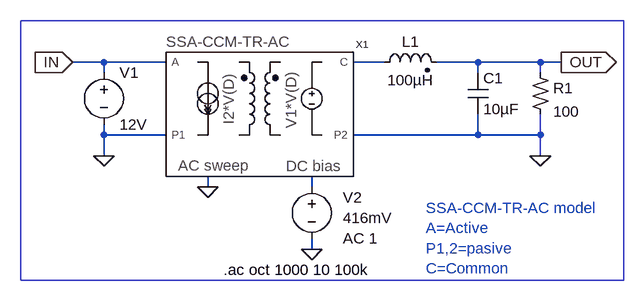
[diagram p0: schematic Switch-Mode_Power_Supplies_-_Basso-_Figure_2-8.asc]
Switch-Mode_Power_Supplies_-_Basso-_Figure_2-8.asc, the LTspice schematic file:
Version 4
SHEET 1 880 680
WIRE -416 -32 -464 -32
WIRE -320 -32 -416 -32
WIRE 16 -32 -32 -32
WIRE 160 -32 96 -32
WIRE 256 -32 160 -32
WIRE 288 -32 256 -32
WIRE -416 -16 -416 -32
WIRE 160 -16 160 -32
WIRE 256 -16 256 -32
WIRE -416 80 -416 64
WIRE -320 80 -416 80
WIRE 160 80 160 48
WIRE 160 80 -32 80
WIRE 256 80 256 48
WIRE 256 80 160 80
WIRE -416 112 -416 80
WIRE 256 112 256 80
WIRE -256 160 -256 144
WIRE -96 160 -96 144
WIRE -96 256 -96 240
FLAG -416 112 0
FLAG -96 256 0
FLAG 288 -32 OUT
IOPIN 288 -32 Out
FLAG -464 -32 IN
IOPIN -464 -32 In
FLAG 256 112 0
FLAG -256 160 0
SYMBOL voltage -416 -32 R0
WINDOW 123 0 0 Left 0
WINDOW 39 0 0 Left 0
SYMATTR InstName V1
SYMATTR Value 12V
SYMBOL voltage -96 144 R0
WINDOW 123 48 95 Left 0
WINDOW 39 0 0 Left 0
WINDOW 0 48 32 Left 0
WINDOW 3 48 64 Left 0
SYMATTR Value2 AC 1
SYMATTR InstName V2
SYMATTR Value 416mV
SYMBOL ind2 0 -16 R270
WINDOW 0 32 56 VTop 0
WINDOW 3 4 56 VBottom 0
SYMATTR InstName L1
SYMATTR Value 100µH
SYMBOL cap 144 -16 R0
SYMATTR InstName C1
SYMATTR Value 10µF
SYMBOL res2 240 -16 R0
SYMATTR InstName R1
SYMATTR Value 100
SYMBOL SSA-CCM-TR-AC -176 128 R0
SYMATTR InstName X1
TEXT -232 288 Left 0 !.ac oct 1000 10 100k
TEXT 80 192 Left 0 ;SSA-CCM-TR-AC model\nA=Active\nP1,2=pasive\nC=Common
RECTANGLE Normal 384 304 -544 -96

The netlist it stands for:
* Switch-Mode_Power_Supplies_-_Basso-_Figure_2-8.asc
V1 IN 0 12V
V2 N002 0 416mV AC 1
L1 N001 OUT 100µH
C1 OUT 0 10µF
R1 OUT 0 100
XX1 IN 0 N002 N001 0 0 SSA-CCM-TR-AC  ; pins A P1 D C P2 AC
.ac oct 1000 10 100k
* SSA-CCM-TR-AC model
* A=Active
* P1,2=pasive
* C=Common
.backanno
.end